# Altium schematic sheet Comparator.SchDoc
size A3; Organization: Altium Limited; Address1: L3, 12a Rodborough Rd; Address2: Frenchs Forest; Address3: NSW; Address4: Australia 2086; DocumentNumber: 5; SheetNumber: 5; SheetTotal: 19
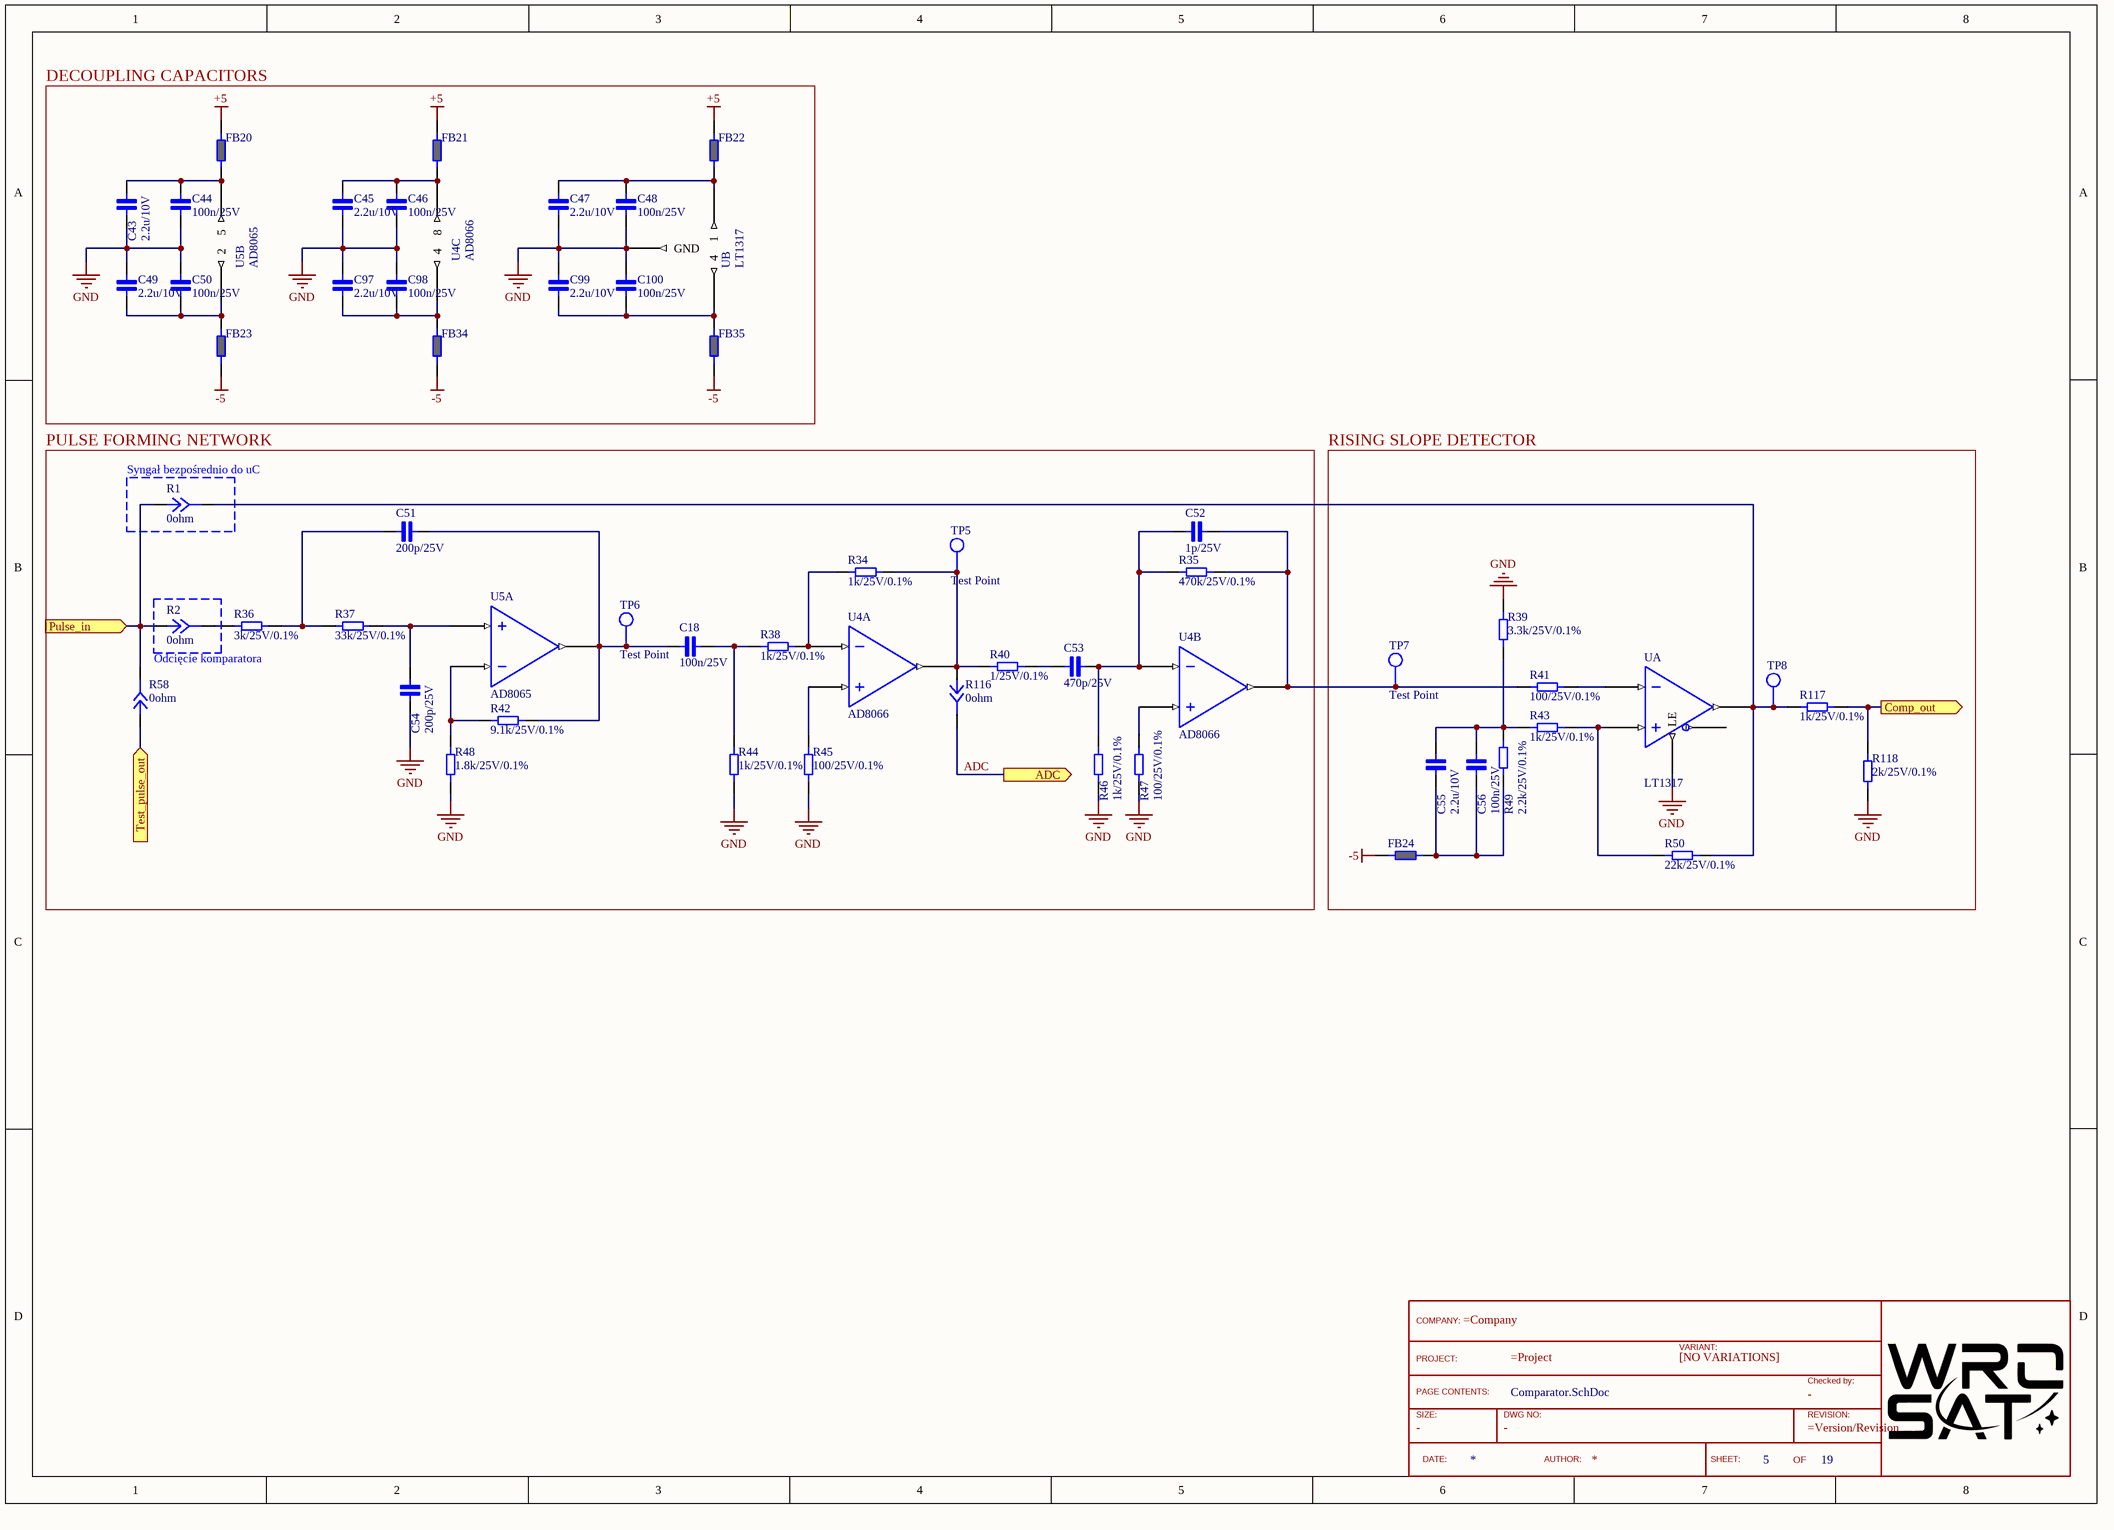
[diagram p0: Comparator.SchDoc]

## Parts
?  TitleBlock  (value not drawn)  (graphical)
C18  100n/25V  [Cap_0402]
C43  2.2u/10V  [Cap_0402]
C44  100n/25V  [Cap_0402]
C45  2.2u/10V  [Cap_0402]
C46  100n/25V  [Cap_0402]
C47  2.2u/10V  [Cap_0402]
C48  100n/25V  [Cap_0402]
C49  2.2u/10V  [Cap_0402]
C50  100n/25V  [Cap_0402]
C51  200p/25V  [Cap_0402]
C52  1p/25V  [Cap_0402]
C53  470p/25V  [Cap_0402]
C54  200p/25V  [Cap_0402]
C55  2.2u/10V  [Cap_0402]
C56  100n/25V  [Cap_0402]
C97  2.2u/10V  [Cap_0402]
C98  100n/25V  [Cap_0402]
C99  2.2u/10V  [Cap_0402]
C100  100n/25V  [Cap_0402]
FB20  Ferrite_bead_0402  [FERRITE_0402]  (value not drawn)
FB21  Ferrite_bead_0402  [FERRITE_0402]  (value not drawn)
FB22  Ferrite_bead_0402  [FERRITE_0402]  (value not drawn)
FB23  Ferrite_bead_0402  [FERRITE_0402]  (value not drawn)
FB24  Ferrite_bead_0402  [FERRITE_0402]  (value not drawn)
FB34  Ferrite_bead_0402  [FERRITE_0402]  (value not drawn)
FB35  Ferrite_bead_0402  [FERRITE_0402]  (value not drawn)
R1  0ohm  [Jumper 2]
R2  0ohm  [Jumper 2]
R34  1k/25V/0.1%  [RES_0402]
R35  470k/25V/0.1%  [RES_0402]
R36  3k/25V/0.1%  [RES_0402]
R37  33k/25V/0.1%  [RES_0402]
R38  1k/25V/0.1%  [RES_0402]
R39  3.3k/25V/0.1%  [RES_0402]
R40  1/25V/0.1%  [RES_0402]
R41  100/25V/0.1%  [RES_0402]
R42  9.1k/25V/0.1%  [RES_0402]
R43  1k/25V/0.1%  [RES_0402]
R44  1k/25V/0.1%  [RES_0402]
R45  100/25V/0.1%  [RES_0402]
R46  1k/25V/0.1%  [RES_0402]
R47  100/25V/0.1%  [RES_0402]
R48  1.8k/25V/0.1%  [RES_0402]
R49  2.2k/25V/0.1%  [RES_0402]
R50  22k/25V/0.1%  [RES_0402]
R58  0ohm  [Jumper 2]
R116  0ohm  [Jumper 2]
R117  1k/25V/0.1%  [RES_0402]
R118  2k/25V/0.1%  [RES_0402]
TP5  Test Point  [Test Point SMT]
TP6  Test Point  [Test Point SMT]
TP7  Test Point  [Test Point SMT]
TP8  Test Point  [Test Point SMT]  (value not drawn)
U  LT1317  [MSOP-8]  (parts A,B of 2)
U4  AD8066  [SOIC8]  (parts A,B,C of 3)
U5  AD8065  [SOT-23-5]  (parts A,B of 2)

## Blocks framed on the sheet
DECOUPLING CAPACITORS: C43-C50 C97-C100 FB20-FB23 FB34 FB35 U U4 U5
PULSE FORMING NETWORK: C18 C51-C54 R2 R34-R38 R40 R42 R44-R48 R58 R116 TP5 TP6 U4 U5
RISING SLOPE DETECTOR: C55 C56 FB24 R39 R41 R43 R49 R50 R117 R118 TP7 TP8 U
Syngał bezpośrednio do uC: R1

## Ports
ADC (out), Comp_out (out), Pulse_in (in), Test_pulse_out (in)

## Nets
+5: FB20.2 FB21.2 FB22.2
-5: FB23.1 FB24.1 FB34.1 FB35.1
GND: C43.1 C44.1 C45.1 C46.1 C47.1 C48.1 C49.2 C50.2 C54.1 C97.2 C98.2 C99.2 C100.2 R39.2 R44.1 R45.1 R46.2 R47.1 R48.1 R118.1 U.5(LE) U.6(GND)
ADC: R116.2 ; port ADC
Comp_out: R117.2 R118.2 ; port Comp_out
Pulse_in: R1.1 R2.1 R58.2 ; port Pulse_in
Test_pulse_out: R58.1 ; port Test_pulse_out
NetC18_1: C18.1 C51.2 R42.2 TP6.1 U5.1
NetC18_2: C18.2 R38.2 R44.2
NetC43_2: C43.2 C44.2 FB20.1 U5.5
NetC45_2: C45.2 C46.2 FB21.1 U4.8
NetC47_2: C47.2 C48.2 FB22.1 U.1
NetC49_1: C49.1 C50.1 FB23.2 U5.2
NetC51_1: C51.1 R36.2 R37.1
NetC52_1: C52.1 C53.2 R35.2 R46.1 U4.6
NetC52_2: C52.2 R35.1 R41.1 TP7.1 U4.7
NetC53_1: C53.1 R40.2
NetC54_2: C54.2 R37.2 U5.3
NetC55_1: C55.1 C56.1 FB24.2 R49.1
NetC55_2: C55.2 C56.2 R39.1 R43.1 R49.2
NetC97_1: C97.1 C98.1 FB34.2 U4.4
NetC99_1: C99.1 C100.1 FB35.2 U.4
NetR1_2: R1.2 R50.2 R117.1 TP8.1 U.7
NetR2_2: R2.2 R36.1
NetR34_1: R34.1 R40.1 R116.1 TP5.1 U4.1
NetR34_2: R34.2 R38.1 U4.2
NetR41_2: R41.2 U.3
NetR42_1: R42.1 R48.2 U5.4
NetR43_2: R43.2 R50.1 U.2
NetR45_2: R45.2 U4.3
NetR47_2: R47.2 U4.5

Not connected (* = marked no-connect by the designer): U 8

## Notes on the sheet
- Odcięcie komparatora
- Title
- Size:
- Date:
- A3
- Number:
- Time:
- Revision:
- Sheet
- of
- File:
- (in symbol TitleBlock) COMPANY:; VARIANT:; PROJECT:; [NO VARIATIONS]; Checked by:; PAGE CONTENTS:; SIZE:; DWG NO:; REVISION:; DATE:; AUTHOR:; SHEET:; OF

## Library data of the parts
? = TitleBlock: Standard TitleBlock; DrawingNo: -; Size: -; Checked: -
C18 C44 C46 C48 C50 C56 C98 C100 = Cap_0402_100n: Ceramic Capacitor 100n / 0402 / 25V / ±5%, Wurth Elektronik MLCC; ComponentLink1Description: New link; ComponentLink1URL: https://www.we-online.com/catalog/en/WCAP-CSGP-25VDC
C43 C45 C47 C49 C55 C97 C99 = Cap_0402_2.2u: Ceramic Capacitor 2.2uF / 0402 / 10V / ±5%, Wurth Elektronik MLCC
C51 C54 = Cap_0402_200p: 0402 / 25V / ±5%, Wurth Elektronik MLCC; ComponentLink1Description: New link; ComponentLink1URL: https://www.we-online.com/catalog/en/WCAP-CSGP-25VDC
C52 = Cap_0402_1p: 0402 / 25V / ±5%, Wurth Elektronik MLCC; ComponentLink1Description: New link; ComponentLink1URL: https://www.we-online.com/catalog/en/WCAP-CSGP-25VDC
C53 = Cap_0402_470p: 0402 / 25V / ±5%, Wurth Elektronik MLCC; ComponentLink1Description: New link; ComponentLink1URL: https://www.we-online.com/catalog/en/WCAP-CSGP-25VDC
FB20-FB24 FB34 FB35 = Ferrite_bead_0402: Ferrite bead, wurth 74269241102
R1 R2 R58 R116 = Jumper
R34 R38 R43 R44 R46 R117 R118 = Res_0402_1k: Vishay, thin film resistor 1k/25V/0.1%
R35 = Res_0402_470k: Vishay, thin film resistor 470k/25V/0.1%
R36 = Res_0402_3k: Vishay, thin film resistor 3k/25V/0.1%
R37 = Res_0402_33k: Vishay, thin film resistor 33k/25V/0.1%
R39 = Res_0402_3.3k: Vishay, thin film resistor 3.3k/25V/0.1%
R40 = Res_0402_1: Vishay, thin film resistor 1/25V/0.1%
R41 R45 R47 = Res_0402_100: Vishay, thin film resistor 100/25V/0.1%
R42 = Res_0402_9.1k: Vishay, thin film resistor 9.1k/25V/0.1%
R48 = Res_0402_1.8k: Vishay, thin film resistor 1.8k/25V/0.1%
R49 = Res_0402_2.2k: Vishay, thin film resistor 2.2k/25V/0.1%
R50 = Res_0402_22k: Vishay, thin film resistor 20k/25V/0.1%
U = LT1317: Single, 7ns, Low Power, / 3V/5V/±5V Rail-to-Rail Comparators; ComponentLink1Description: New link; ComponentLink1URL: https://pl.mouser.com/ProductDetail/Analog-Devices/LT1713CMS8PBF?qs=ytflclh7QUW98nqGG0sqzA%3D%3D
U4 = AD8066: High Performance, 145 MHz / FastFET Op Amps; ComponentLink1Description: New link; ComponentLink1URL: https://pl.mouser.com/ProductDetail/Analog-Devices/AD8066ARZ-R7?qs=%2FtpEQrCGXCwSsy1qvxfKJg%3D%3D
U5 = AD8065: High Performance, 145 MHz / FastFET Op Amps; ComponentLink1Description: New link; ComponentLink1URL: https://pl.mouser.com/datasheet/2/609/AD8065_8066-1502028.pdf